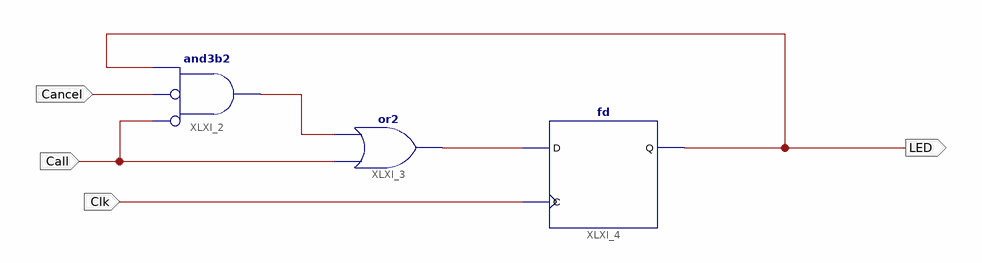
[diagram p0: schematic sheet 1]
// Xilinx ISE schematic FA_Schematic.sch (spartan3e) as structural Verilog: 3 symbols, 4 ports
module FA_Schematic (
  input  Cancel,
  input  Call,
  input  Clk,
  output LED
);

  wire XLXN_7, XLXN_8;

  and XLXI_2 (XLXN_7, ~Call, ~Cancel, LED);  // and3b2
  or XLXI_3 (XLXN_8, Call, XLXN_7);
  fd XLXI_4 (.C(Clk), .D(XLXN_8), .Q(LED));
endmodule
